# Altium schematic sheet IN.SchDoc
size 69 x 64 mm
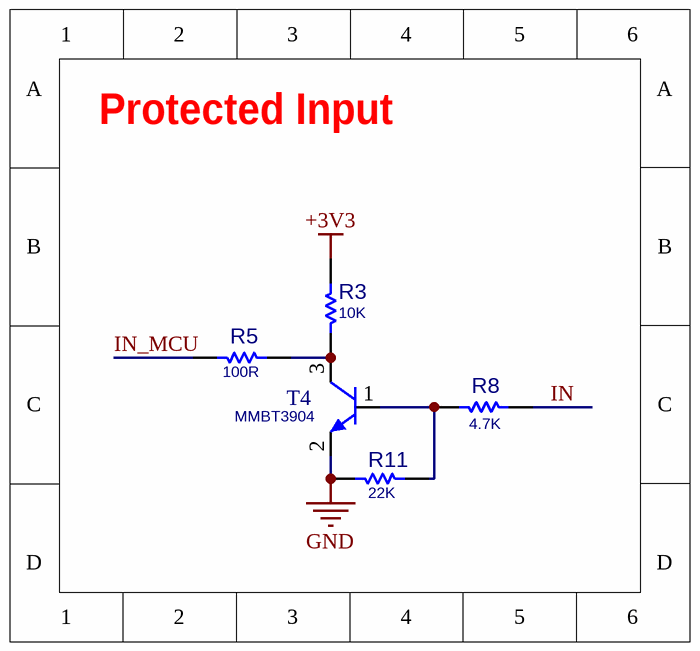
[diagram p0: IN.SchDoc]

## Parts
R3  10K  [R0603]
R5  100R  [R0603]
R8  4.7K  [R0603]
R11  22K  [R0603]
T4  MMBT3904  [SOT23_3]

## Nets
+3V3: R3.2
GND: R11.1 T4.2(E)
IN: R8.2
IN_MCU: R5.1
NetR3_1: R3.1 R5.2 T4.3(C)
NetR8_1: R8.1 R11.2 T4.1(B)

## Notes on the sheet
- Protected Input

## Library data of the parts
R3 R5 R8 R11 = RES_SMD: RES, SMD; MANF_P#: RK73H1ETTP4701F; MANF: KOA SPEER; PARAM: 0.063W; DESC: DESCRIPTION; DIST#: MOUSER; PARAM2: 1%; ASSEMBLY: ASSEMBLY; PRICE: 100= 0.5$
  R3: VALUE: 10K
  R5: VALUE: 100R
  R8: VALUE: 4.7K
  R11: VALUE: 22K
T4 = NPN_MMBT3904_SOT23: BJT, NPN, 40v, 0.2A, SMD, SOT23; PARAM2: 250mW; MANF: Diodes, NXP, FAIRCHILD, ON; PARAM: 40v, 0.2A; MANF_P#: MMBT3904; VALUE: MMBT3904